# EAGLE design LED_Cube_Board (EAGLE 8.7.1)
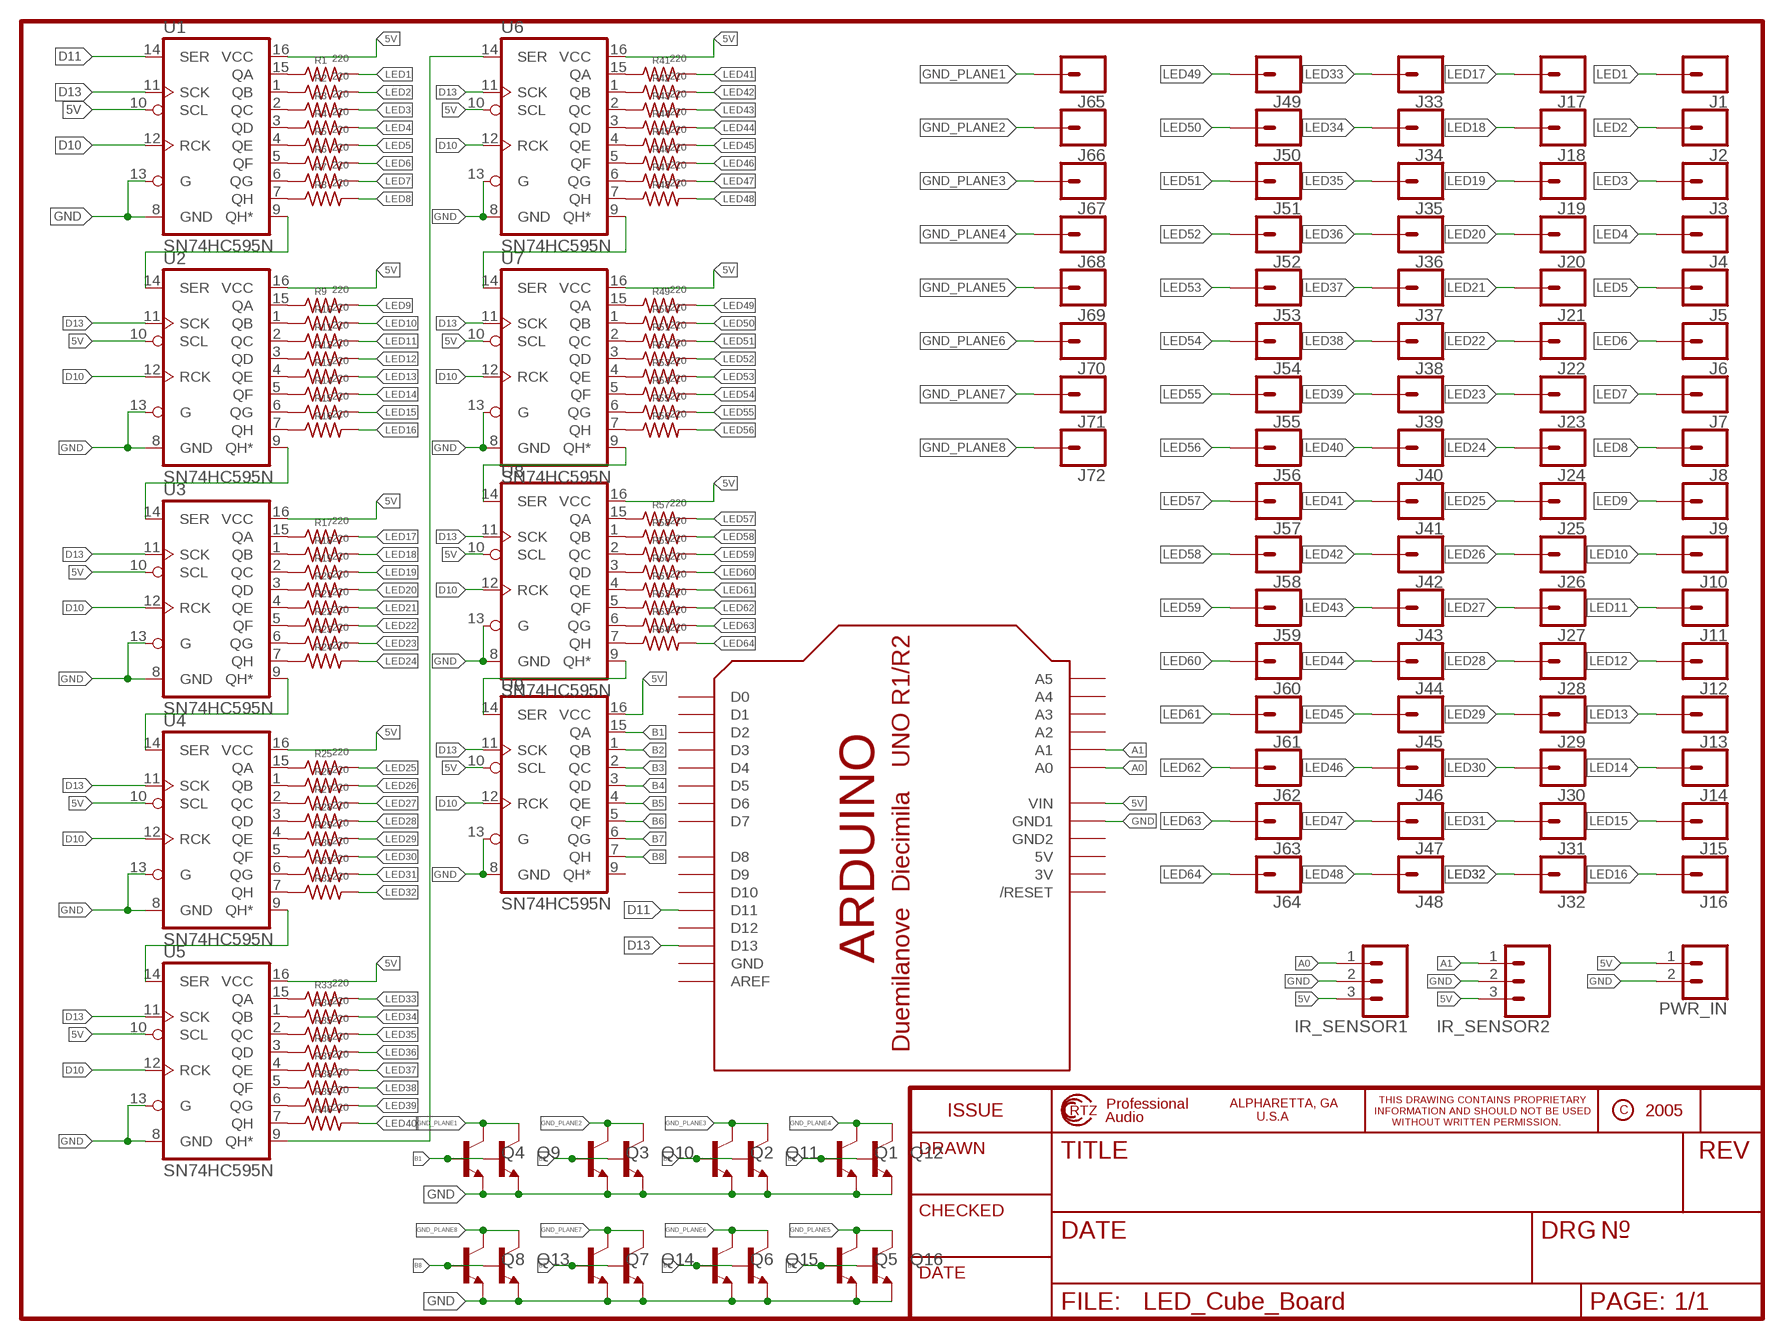
[diagram p0: schematic, sheet 1]

## Parts
IR_SENSOR1  CONN_03  [1X03]
IR_SENSOR2  CONN_03  [1X03]
J1  CONN_01  [1X01]
J2  CONN_01  [1X01]
J3  CONN_01  [1X01]
J4  CONN_01  [1X01]
J5  CONN_01  [1X01]
J6  CONN_01  [1X01]
J7  CONN_01  [1X01]
J8  CONN_01  [1X01]
J9  CONN_01  [1X01]
J10  CONN_01  [1X01]
J11  CONN_01  [1X01]
J12  CONN_01  [1X01]
J13  CONN_01  [1X01]
J14  CONN_01  [1X01]
J15  CONN_01  [1X01]
J16  CONN_01  [1X01]
J17  CONN_01  [1X01]
J18  CONN_01  [1X01]
J19  CONN_01  [1X01]
J20  CONN_01  [1X01]
J21  CONN_01  [1X01]
J22  CONN_01  [1X01]
J23  CONN_01  [1X01]
J24  CONN_01  [1X01]
J25  CONN_01  [1X01]
J26  CONN_01  [1X01]
J27  CONN_01  [1X01]
J28  CONN_01  [1X01]
J29  CONN_01  [1X01]
J30  CONN_01  [1X01]
J31  CONN_01  [1X01]
J32  CONN_01  [1X01]
J33  CONN_01  [1X01]
J34  CONN_01  [1X01]
J35  CONN_01  [1X01]
J36  CONN_01  [1X01]
J37  CONN_01  [1X01]
J38  CONN_01  [1X01]
J39  CONN_01  [1X01]
J40  CONN_01  [1X01]
J41  CONN_01  [1X01]
J42  CONN_01  [1X01]
J43  CONN_01  [1X01]
J44  CONN_01  [1X01]
J45  CONN_01  [1X01]
J46  CONN_01  [1X01]
J47  CONN_01  [1X01]
J48  CONN_01  [1X01]
J49  CONN_01  [1X01]
J50  CONN_01  [1X01]
J51  CONN_01  [1X01]
J52  CONN_01  [1X01]
J53  CONN_01  [1X01]
J54  CONN_01  [1X01]
J55  CONN_01  [1X01]
J56  CONN_01  [1X01]
J57  CONN_01  [1X01]
J58  CONN_01  [1X01]
J59  CONN_01  [1X01]
J60  CONN_01  [1X01]
J61  CONN_01  [1X01]
J62  CONN_01  [1X01]
J63  CONN_01  [1X01]
J64  CONN_01  [1X01]
J65  CONN_01  [1X01]
J66  CONN_01  [1X01]
J67  CONN_01  [1X01]
J68  CONN_01  [1X01]
J69  CONN_01  [1X01]
J70  CONN_01  [1X01]
J71  CONN_01  [1X01]
J72  CONN_01  [1X01]
PWR_IN  CONN_02  [1X02]
Q1  TRANSISTOR_NPNTO92  [TO-92]
Q2  TRANSISTOR_NPNTO92  [TO-92]
Q3  TRANSISTOR_NPNTO92  [TO-92]
Q4  TRANSISTOR_NPNTO92  [TO-92]
Q5  TRANSISTOR_NPNTO92  [TO-92]
Q6  TRANSISTOR_NPNTO92  [TO-92]
Q7  TRANSISTOR_NPNTO92  [TO-92]
Q8  TRANSISTOR_NPNTO92  [TO-92]
Q9  TRANSISTOR_NPNTO92  [TO-92]
Q10  TRANSISTOR_NPNTO92  [TO-92]
Q11  TRANSISTOR_NPNTO92  [TO-92]
Q12  TRANSISTOR_NPNTO92  [TO-92]
Q13  TRANSISTOR_NPNTO92  [TO-92]
Q14  TRANSISTOR_NPNTO92  [TO-92]
Q15  TRANSISTOR_NPNTO92  [TO-92]
Q16  TRANSISTOR_NPNTO92  [TO-92]
R1  220  R-US_R0805  [R0805]
R2  220  R-US_R0805  [R0805]
R3  220  R-US_R0805  [R0805]
R4  220  R-US_R0805  [R0805]
R5  220  R-US_R0805  [R0805]
R6  220  R-US_R0805  [R0805]
R7  220  R-US_R0805  [R0805]
R8  220  R-US_R0805  [R0805]
R9  220  R-US_R0805  [R0805]
R10  220  R-US_R0805  [R0805]
R11  220  R-US_R0805  [R0805]
R12  220  R-US_R0805  [R0805]
R13  220  R-US_R0805  [R0805]
R14  220  R-US_R0805  [R0805]
R15  220  R-US_R0805  [R0805]
R16  220  R-US_R0805  [R0805]
R17  220  R-US_R0805  [R0805]
R18  220  R-US_R0805  [R0805]
R19  220  R-US_R0805  [R0805]
R20  220  R-US_R0805  [R0805]
R21  220  R-US_R0805  [R0805]
R22  220  R-US_R0805  [R0805]
R23  220  R-US_R0805  [R0805]
R24  220  R-US_R0805  [R0805]
R25  220  R-US_R0805  [R0805]
R26  220  R-US_R0805  [R0805]
R27  220  R-US_R0805  [R0805]
R28  220  R-US_R0805  [R0805]
R29  220  R-US_R0805  [R0805]
R30  220  R-US_R0805  [R0805]
R31  220  R-US_R0805  [R0805]
R32  220  R-US_R0805  [R0805]
R33  220  R-US_R0805  [R0805]
R34  220  R-US_R0805  [R0805]
R35  220  R-US_R0805  [R0805]
R36  220  R-US_R0805  [R0805]
R37  220  R-US_R0805  [R0805]
R38  220  R-US_R0805  [R0805]
R39  220  R-US_R0805  [R0805]
R40  220  R-US_R0805  [R0805]
R41  220  R-US_R0805  [R0805]
R42  220  R-US_R0805  [R0805]
R43  220  R-US_R0805  [R0805]
R44  220  R-US_R0805  [R0805]
R45  220  R-US_R0805  [R0805]
R46  220  R-US_R0805  [R0805]
R47  220  R-US_R0805  [R0805]
R48  220  R-US_R0805  [R0805]
R49  220  R-US_R0805  [R0805]
R50  220  R-US_R0805  [R0805]
R51  220  R-US_R0805  [R0805]
R52  220  R-US_R0805  [R0805]
R53  220  R-US_R0805  [R0805]
R54  220  R-US_R0805  [R0805]
R55  220  R-US_R0805  [R0805]
R56  220  R-US_R0805  [R0805]
R57  220  R-US_R0805  [R0805]
R58  220  R-US_R0805  [R0805]
R59  220  R-US_R0805  [R0805]
R60  220  R-US_R0805  [R0805]
R61  220  R-US_R0805  [R0805]
R62  220  R-US_R0805  [R0805]
R63  220  R-US_R0805  [R0805]
R64  220  R-US_R0805  [R0805]
U1  SN74HC595N  74HC595N  [DIP16]
U2  SN74HC595N  74HC595N  [DIP16]
U3  SN74HC595N  74HC595N  [DIP16]
U4  SN74HC595N  74HC595N  [DIP16]
U5  SN74HC595N  74HC595N  [DIP16]
U6  SN74HC595N  74HC595N  [DIP16]
U7  SN74HC595N  74HC595N  [DIP16]
U8  SN74HC595N  74HC595N  [DIP16]
U9  SN74HC595N  74HC595N  [DIP16]
U$1  ARDUINO-BPLACE  [ARDUINO-BPLACE]

## Nets
5V: IR_SENSOR1.3 IR_SENSOR2.3 PWR_IN.1 U1.10(SCL) U1.16(VCC) U2.10(SCL) U2.16(VCC) U3.10(SCL) U3.16(VCC) U4.10(SCL) U4.16(VCC) U5.10(SCL) U5.16(VCC) U6.10(SCL) U6.16(VCC) U7.10(SCL) U7.16(VCC) U8.10(SCL) U8.16(VCC) U9.10(SCL) U9.16(VCC) U$1.VIN
A0: IR_SENSOR1.1 U$1.A0
A1: IR_SENSOR2.1 U$1.A1
B1: Q4.2(B) Q9.2(B) U9.15(QA)
B2: Q3.2(B) Q10.2(B) U9.1(QB)
B3: Q2.2(B) Q11.2(B) U9.2(QC)
B4: Q1.2(B) Q12.2(B) U9.3(QD)
B5: Q5.2(B) Q16.2(B) U9.4(QE)
B6: Q6.2(B) Q15.2(B) U9.5(QF)
B7: Q7.2(B) Q14.2(B) U9.6(QG)
B8: Q8.2(B) Q13.2(B) U9.7(QH)
D10: U1.12(RCK) U2.12(RCK) U3.12(RCK) U4.12(RCK) U5.12(RCK) U6.12(RCK) U7.12(RCK) U8.12(RCK) U9.12(RCK)
D11: U1.14(SER) U$1.D11
D13: U1.11(SCK) U2.11(SCK) U3.11(SCK) U4.11(SCK) U5.11(SCK) U6.11(SCK) U7.11(SCK) U8.11(SCK) U9.11(SCK) U$1.D13
GND: IR_SENSOR1.2 IR_SENSOR2.2 PWR_IN.2 Q1.1(E) Q2.1(E) Q3.1(E) Q4.1(E) Q5.1(E) Q6.1(E) Q7.1(E) Q8.1(E) Q9.1(E) Q10.1(E) Q11.1(E) Q12.1(E) Q13.1(E) Q14.1(E) Q15.1(E) Q16.1(E) U1.8(GND) U1.13(G) U2.8(GND) U2.13(G) U3.8(GND) U3.13(G) U4.8(GND) U4.13(G) U5.8(GND) U5.13(G) U6.8(GND) U6.13(G) U7.8(GND) U7.13(G) U8.8(GND) U8.13(G) U9.8(GND) U9.13(G) U$1.GND1
GND_PLANE1: J65.1 Q4.3(C) Q9.3(C)
GND_PLANE2: J66.1 Q3.3(C) Q10.3(C)
GND_PLANE3: J67.1 Q2.3(C) Q11.3(C)
GND_PLANE4: J68.1 Q1.3(C) Q12.3(C)
GND_PLANE5: J69.1 Q5.3(C) Q16.3(C)
GND_PLANE6: J70.1 Q6.3(C) Q15.3(C)
GND_PLANE7: J71.1 Q7.3(C) Q14.3(C)
GND_PLANE8: J72.1 Q8.3(C) Q13.3(C)
LED1: J1.1 R1.2
LED2: J2.1 R2.2
LED3: J3.1 R3.2
LED4: J4.1 R4.2
LED5: J5.1 R5.2
LED6: J6.1 R6.2
LED7: J7.1 R7.2
LED8: J8.1 R8.2
LED9: J9.1 R9.2
LED10: J10.1 R10.2
LED11: J11.1 R11.2
LED12: J12.1 R12.2
LED13: J13.1 R13.2
LED14: J14.1 R14.2
LED15: J15.1 R15.2
LED16: J16.1 R16.2
LED17: J17.1 R17.2
LED18: J18.1 R18.2
LED19: J19.1 R19.2
LED20: J20.1 R20.2
LED21: J21.1 R21.2
LED22: J22.1 R22.2
LED23: J23.1 R23.2
LED24: J24.1 R24.2
LED25: J25.1 R25.2
LED26: J26.1 R26.2
LED27: J27.1 R27.2
LED28: J28.1 R28.2
LED29: J29.1 R29.2
LED30: J30.1 R30.2
LED31: J31.1 R31.2
LED32: J32.1 R32.2
LED33: J33.1 R33.2
LED34: J34.1 R34.2
LED35: J35.1 R35.2
LED36: J36.1 R36.2
LED37: J37.1 R37.2
LED38: J38.1 R38.2
LED39: J39.1 R39.2
LED40: J40.1 R40.2
LED41: J41.1 R41.2
LED42: J42.1 R42.2
LED43: J43.1 R43.2
LED44: J44.1 R44.2
LED45: J45.1 R45.2
LED46: J46.1 R46.2
LED47: J47.1 R47.2
LED48: J48.1 R48.2
LED49: J49.1 R49.2
LED50: J50.1 R50.2
LED51: J51.1 R51.2
LED52: J52.1 R52.2
LED53: J53.1 R53.2
LED54: J54.1 R54.2
LED55: J55.1 R55.2
LED56: J56.1 R56.2
LED57: J57.1 R57.2
LED58: J58.1 R58.2
LED59: J59.1 R59.2
LED60: J60.1 R60.2
LED61: J61.1 R61.2
LED62: J62.1 R62.2
LED63: J63.1 R63.2
LED64: J64.1 R64.2
N$1: R1.1 U1.15(QA)
N$2: R2.1 U1.1(QB)
N$3: R3.1 U1.2(QC)
N$4: U1.9(QH*) U2.14(SER)
N$5: U2.9(QH*) U3.14(SER)
N$6: U3.9(QH*) U4.14(SER)
N$7: U4.9(QH*) U5.14(SER)
N$8: U5.9(QH*) U6.14(SER)
N$9: U6.9(QH*) U7.14(SER)
N$10: U7.9(QH*) U8.14(SER)
N$11: R4.1 U1.3(QD)
N$12: R5.1 U1.4(QE)
N$13: R6.1 U1.5(QF)
N$14: R7.1 U1.6(QG)
N$15: R8.1 U1.7(QH)
N$16: R9.1 U2.15(QA)
N$17: R10.1 U2.1(QB)
N$18: R11.1 U2.2(QC)
N$19: R12.1 U2.3(QD)
N$20: R13.1 U2.4(QE)
N$21: R14.1 U2.5(QF)
N$22: R15.1 U2.6(QG)
N$23: R16.1 U2.7(QH)
N$24: R17.1 U3.15(QA)
N$25: R18.1 U3.1(QB)
N$26: R19.1 U3.2(QC)
N$27: R20.1 U3.3(QD)
N$28: R21.1 U3.4(QE)
N$29: R22.1 U3.5(QF)
N$30: R23.1 U3.6(QG)
N$31: R24.1 U3.7(QH)
N$32: R25.1 U4.15(QA)
N$33: R26.1 U4.1(QB)
N$34: R27.1 U4.2(QC)
N$35: R28.1 U4.3(QD)
N$36: R29.1 U4.4(QE)
N$37: R30.1 U4.5(QF)
N$38: R31.1 U4.6(QG)
N$39: R32.1 U4.7(QH)
N$40: R33.1 U5.15(QA)
N$41: R34.1 U5.1(QB)
N$42: R35.1 U5.2(QC)
N$43: R36.1 U5.3(QD)
N$44: R37.1 U5.4(QE)
N$45: R38.1 U5.5(QF)
N$46: R39.1 U5.6(QG)
N$47: R40.1 U5.7(QH)
N$48: R41.1 U6.15(QA)
N$49: R42.1 U6.1(QB)
N$50: R43.1 U6.2(QC)
N$51: R44.1 U6.3(QD)
N$52: R45.1 U6.4(QE)
N$53: R46.1 U6.5(QF)
N$54: R47.1 U6.6(QG)
N$55: R48.1 U6.7(QH)
N$56: R49.1 U7.15(QA)
N$57: R50.1 U7.1(QB)
N$58: R51.1 U7.2(QC)
N$59: R52.1 U7.3(QD)
N$60: R53.1 U7.4(QE)
N$61: R54.1 U7.5(QF)
N$62: R55.1 U7.6(QG)
N$63: R56.1 U7.7(QH)
N$65: R57.1 U8.15(QA)
N$66: R58.1 U8.1(QB)
N$67: R59.1 U8.2(QC)
N$68: R60.1 U8.3(QD)
N$69: R61.1 U8.4(QE)
N$70: R62.1 U8.5(QF)
N$71: R63.1 U8.6(QG)
N$72: R64.1 U8.7(QH)
N$81: U8.9(QH*) U9.14(SER)
Unconnected: U9.9(QH*) U$1.A2 U$1.A3 U$1.A4 U$1.A5 U$1.AREF U$1.D0 U$1.D1 U$1.D2 U$1.D3 U$1.D4 U$1.D5 U$1.D6 U$1.D7 U$1.D8 U$1.D9 U$1.D10 U$1.D12 U$1.RESET(/RESET)

## Power pins joined to a net without a drawn wire
3V: U$1.3V
5V: U$1.5V
GND: U$1.GND
GND2: U$1.GND2

## Library data of the parts
IR_SENSOR1 IR_SENSOR2 = SparkFun-Connectors:CONN_03: Multi connection point. Often used as Generic Header-pin footprint for 0.1 inch spaced/style header connections On any of the 0.1 inch spaced packages, you can populate with these: Break Away Headers - Straight <https://www.sparkfun.com/products/116> (PRT-00116) Break Away Male Headers - Right Angle <https://www.sparkfun.com/products/553> (PRT-00553) Female Headers <https://www.sparkfun.com/products/115> (PRT-00115) Break Away Headers - Machine Pin <https://www.sparkfun.com/products/117> (PRT-00117) Break Away Female Headers - Swiss Machine Pin <https://www.sparkfun.com/products/743> (PRT-00743) Stackable Header - 3 Pin (Female, 0.1") <https://www.sparkfun.com/products/13875> (PRT-13875) For SCREWTERMINALS and SPRING TERMINALS visit here: Screw Terimnals on SparkFun.com <https://www.sparkfun.com/search/results?term=Screw+Terminals> (5mm/3.5mm/2.54mm spacing) This device is also useful as a general connection point to wire up your design to another part of your project. Our various solder wires solder well into these plated through hole pads. Hook-Up Wire - Assortment (Stranded, 22 AWG) <https://www.sparkfun.com/products/11375> (PRT-11375) Hook-Up Wire - Assortment (Solid Core, 22 AWG) <https://www.sparkfun.com/products/11367> (PRT-11367) View the entire wire category on our website here <https://www.sparkfun.com/categories/141> Special notes: Molex polarized connector foot print use with SKU : PRT-08232 with associated crimp pins and housings.
J1-J72 = SparkFun-Connectors:CONN_01: Single connection point. Often used as Generic Header-pin footprint for 0.1 inch spaced/style header connections On any of the 0.1 inch spaced packages, you can populate with these: Break Away Headers - Straight <https://www.sparkfun.com/products/116> (PRT-00116) Break Away Male Headers - Right Angle <https://www.sparkfun.com/products/553> (PRT-00553) Female Headers <https://www.sparkfun.com/products/115> (PRT-00115) Break Away Headers - Machine Pin <https://www.sparkfun.com/products/117> (PRT-00117) Break Away Female Headers - Swiss Machine Pin <https://www.sparkfun.com/products/743> (PRT-00743) This device is also useful as a general connection point to wire up your design to another part of your project. Our various solder wires solder well into these plated through hole pads. Hook-Up Wire - Assortment (Stranded, 22 AWG) <https://www.sparkfun.com/products/11375> (PRT-11375) Hook-Up Wire - Assortment (Solid Core, 22 AWG) <https://www.sparkfun.com/products/11367> (PRT-11367) View the entire wire category on our website here <https://www.sparkfun.com/categories/141> Special notes: SMTSO-256-ET is a "flush mount" nut for a 4-40 screw. We mostly use this on specialty testbeds; it is a nice way to connect hardware to your PCB at an adjustable hieght. Also note, the SNAP packages are for using a snappable style connector. We sell a baggie of snaps and they are also used on two LilyPad designs: Snap Assortment - 30 pack (male and female) <https://www.sparkfun.com/products/11347> (DEV-11347) LilyPad Arduino SimpleSnap <https://www.sparkfun.com/products/10941> (DEV-10941) LilyPad SimpleSnap Protoboard <https://www.sparkfun.com/products/10940> (DEV-10940)
PWR_IN = SparkFun-Connectors:CONN_02: Multi connection point. Often used as Generic Header-pin footprint for 0.1 inch spaced/style header connections On any of the 0.1 inch spaced packages, you can populate with these: Break Away Headers - Straight <https://www.sparkfun.com/products/116> (PRT-00116) Break Away Male Headers - Right Angle <https://www.sparkfun.com/products/553> (PRT-00553) Female Headers <https://www.sparkfun.com/products/115> (PRT-00115) Break Away Headers - Machine Pin <https://www.sparkfun.com/products/117> (PRT-00117) Break Away Female Headers - Swiss Machine Pin <https://www.sparkfun.com/products/743> (PRT-00743) For SCREWTERMINALS and SPRING TERMINALS visit here: Screw Terimnals on SparkFun.com <https://www.sparkfun.com/search/results?term=Screw+Terminals> (5mm/3.5mm/2.54mm spacing) This device is also useful as a general connection point to wire up your design to another part of your project. Our various solder wires solder well into these plated through hole pads. Hook-Up Wire - Assortment (Stranded, 22 AWG) <https://www.sparkfun.com/products/11375> (PRT-11375) Hook-Up Wire - Assortment (Solid Core, 22 AWG) <https://www.sparkfun.com/products/11367> (PRT-11367) View the entire wire category on our website here <https://www.sparkfun.com/categories/141> Special notes: Molex polarized connector foot print use with: PRT-08233 with associated crimp pins and housings. 2.54_SCREWTERM for use with PRT-10571. 3.5mm Screw Terminal footprints for PRT-08084 5mm Screw Terminal footprints for use with PRT-08432
Q1-Q16 = SparkFun:TRANSISTOR_NPN: Transistor NPN BJT configuration in SOT23 package. MMBT2222 is the common NPN we use. Double check BCE configuration again layout.
R1-R64 = adafruit:R-US_: RESISTOR, American symbol
U1-U9 = SparkFun-IC-Logic:74*595: 8-Bit Shift Register (Serial to Parallel) Datasheet <http://cdn.sparkfun.com/datasheets/BreakoutBoards/MM74HC595.pdf> SparkFun Products SparkFun Shift Register Breakout - 74HC595 <https://www.sparkfun.com/products/10680> (BOB-10680); PROD_ID: IC-13123
U$1 = adafruit:ARDUINO: Arduino Diecimila/Duemilanove Make a shield with ease, this package has all the named pins as well as the two mounting drill holes and an outline of the USB and DC power connector. The outline is on the DIMENSION layer, so if your board house uses it they will cut the outline to match. http://www.ladyada.net/library/pcb/eaglelibrary.html

## Board
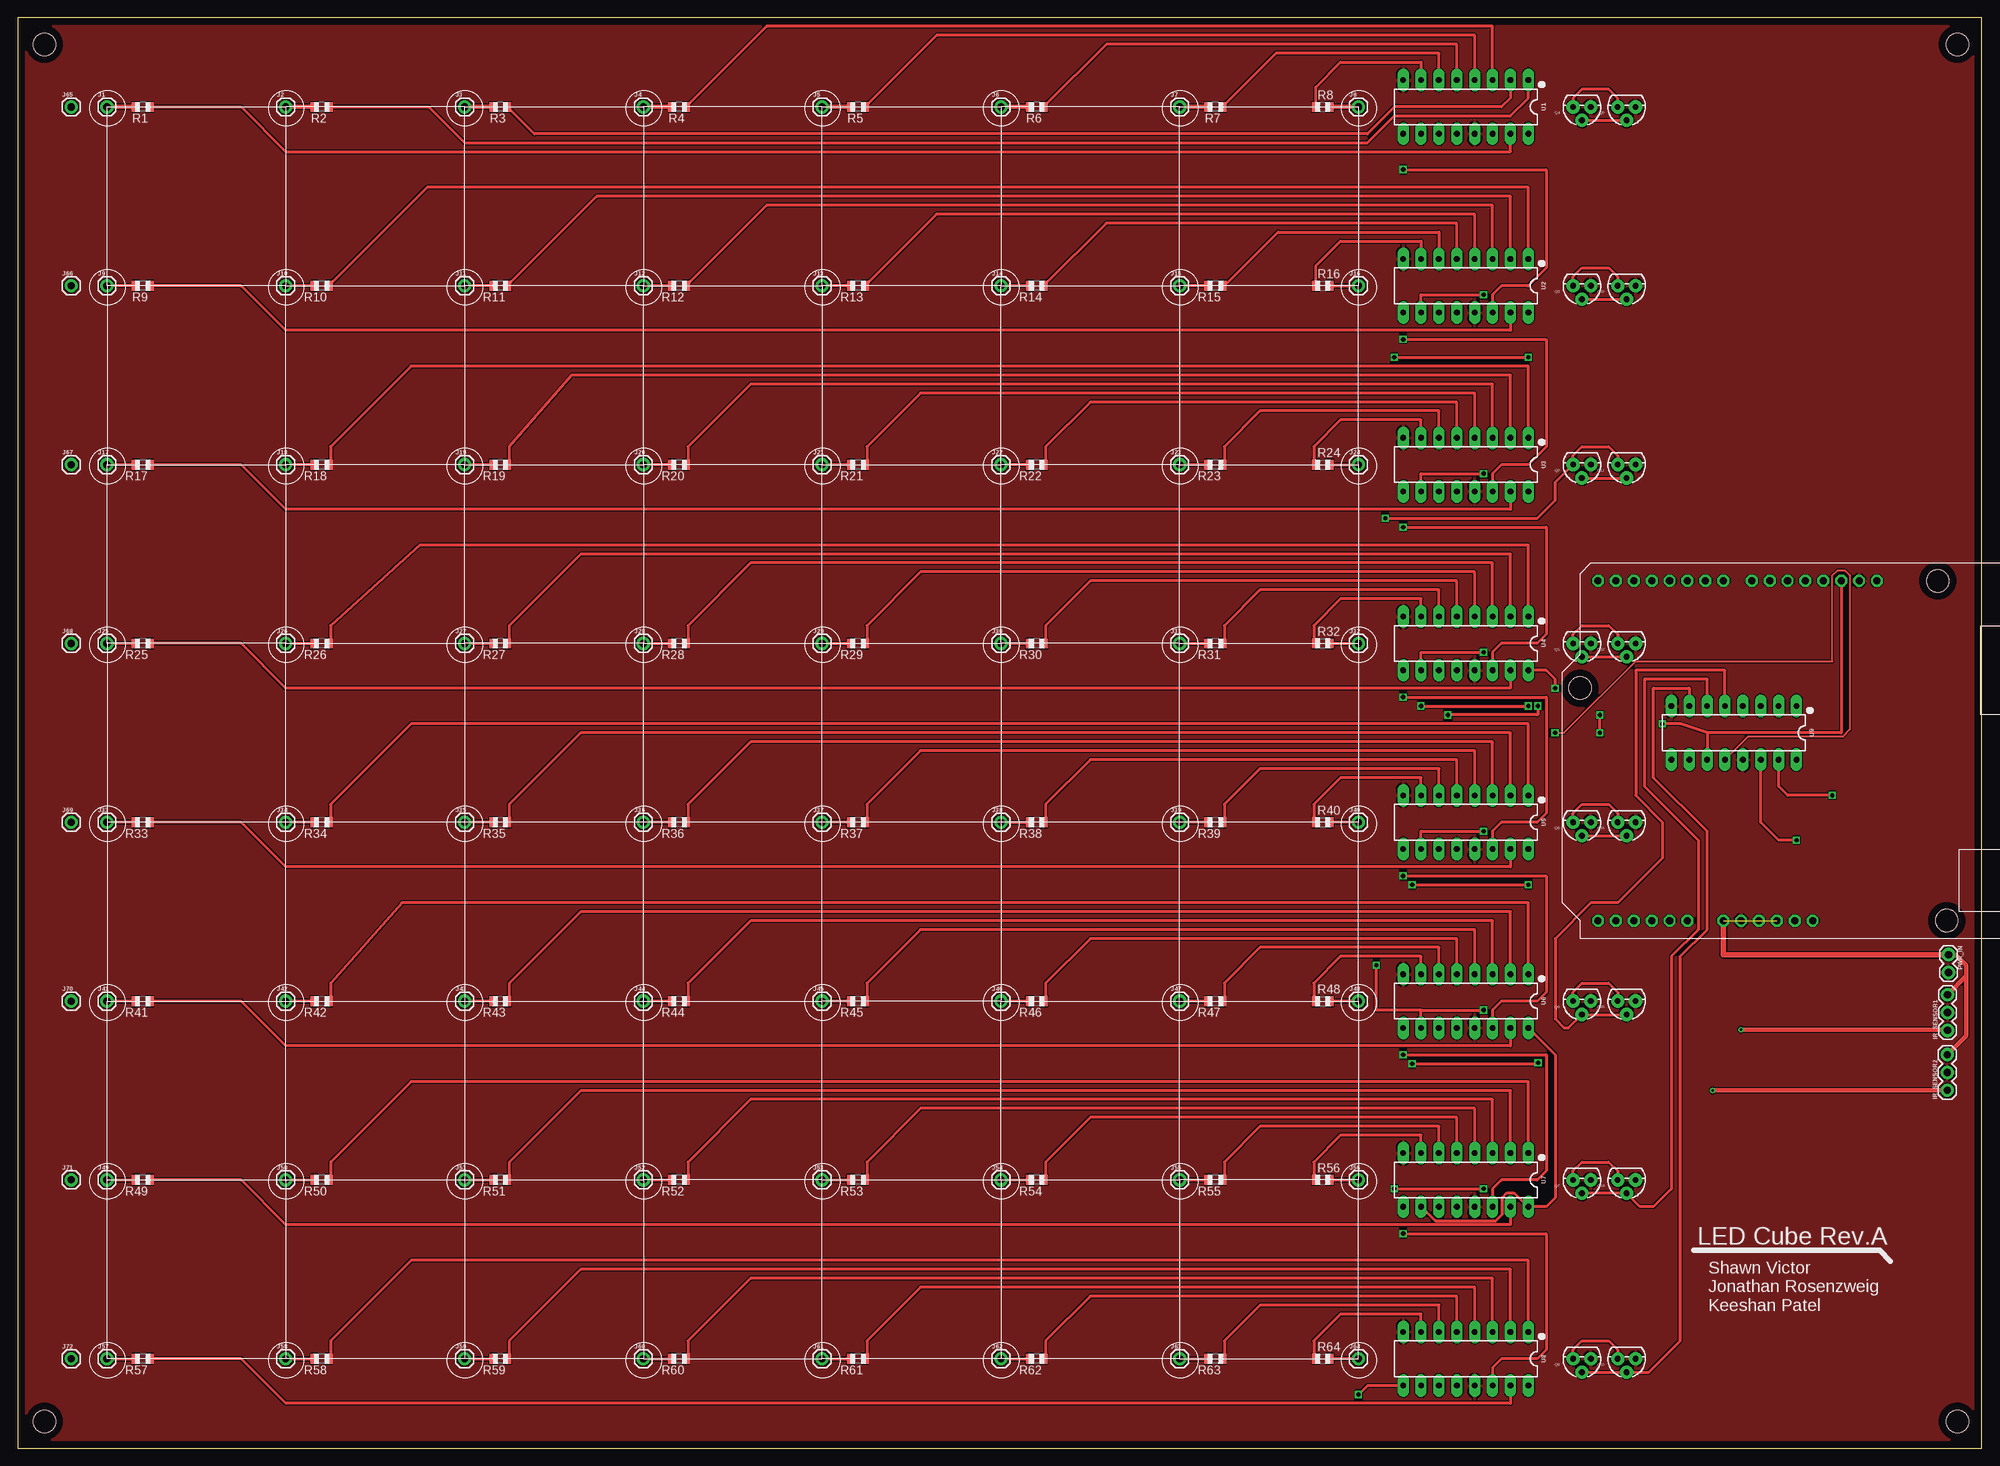
[diagram p1: board, top side]
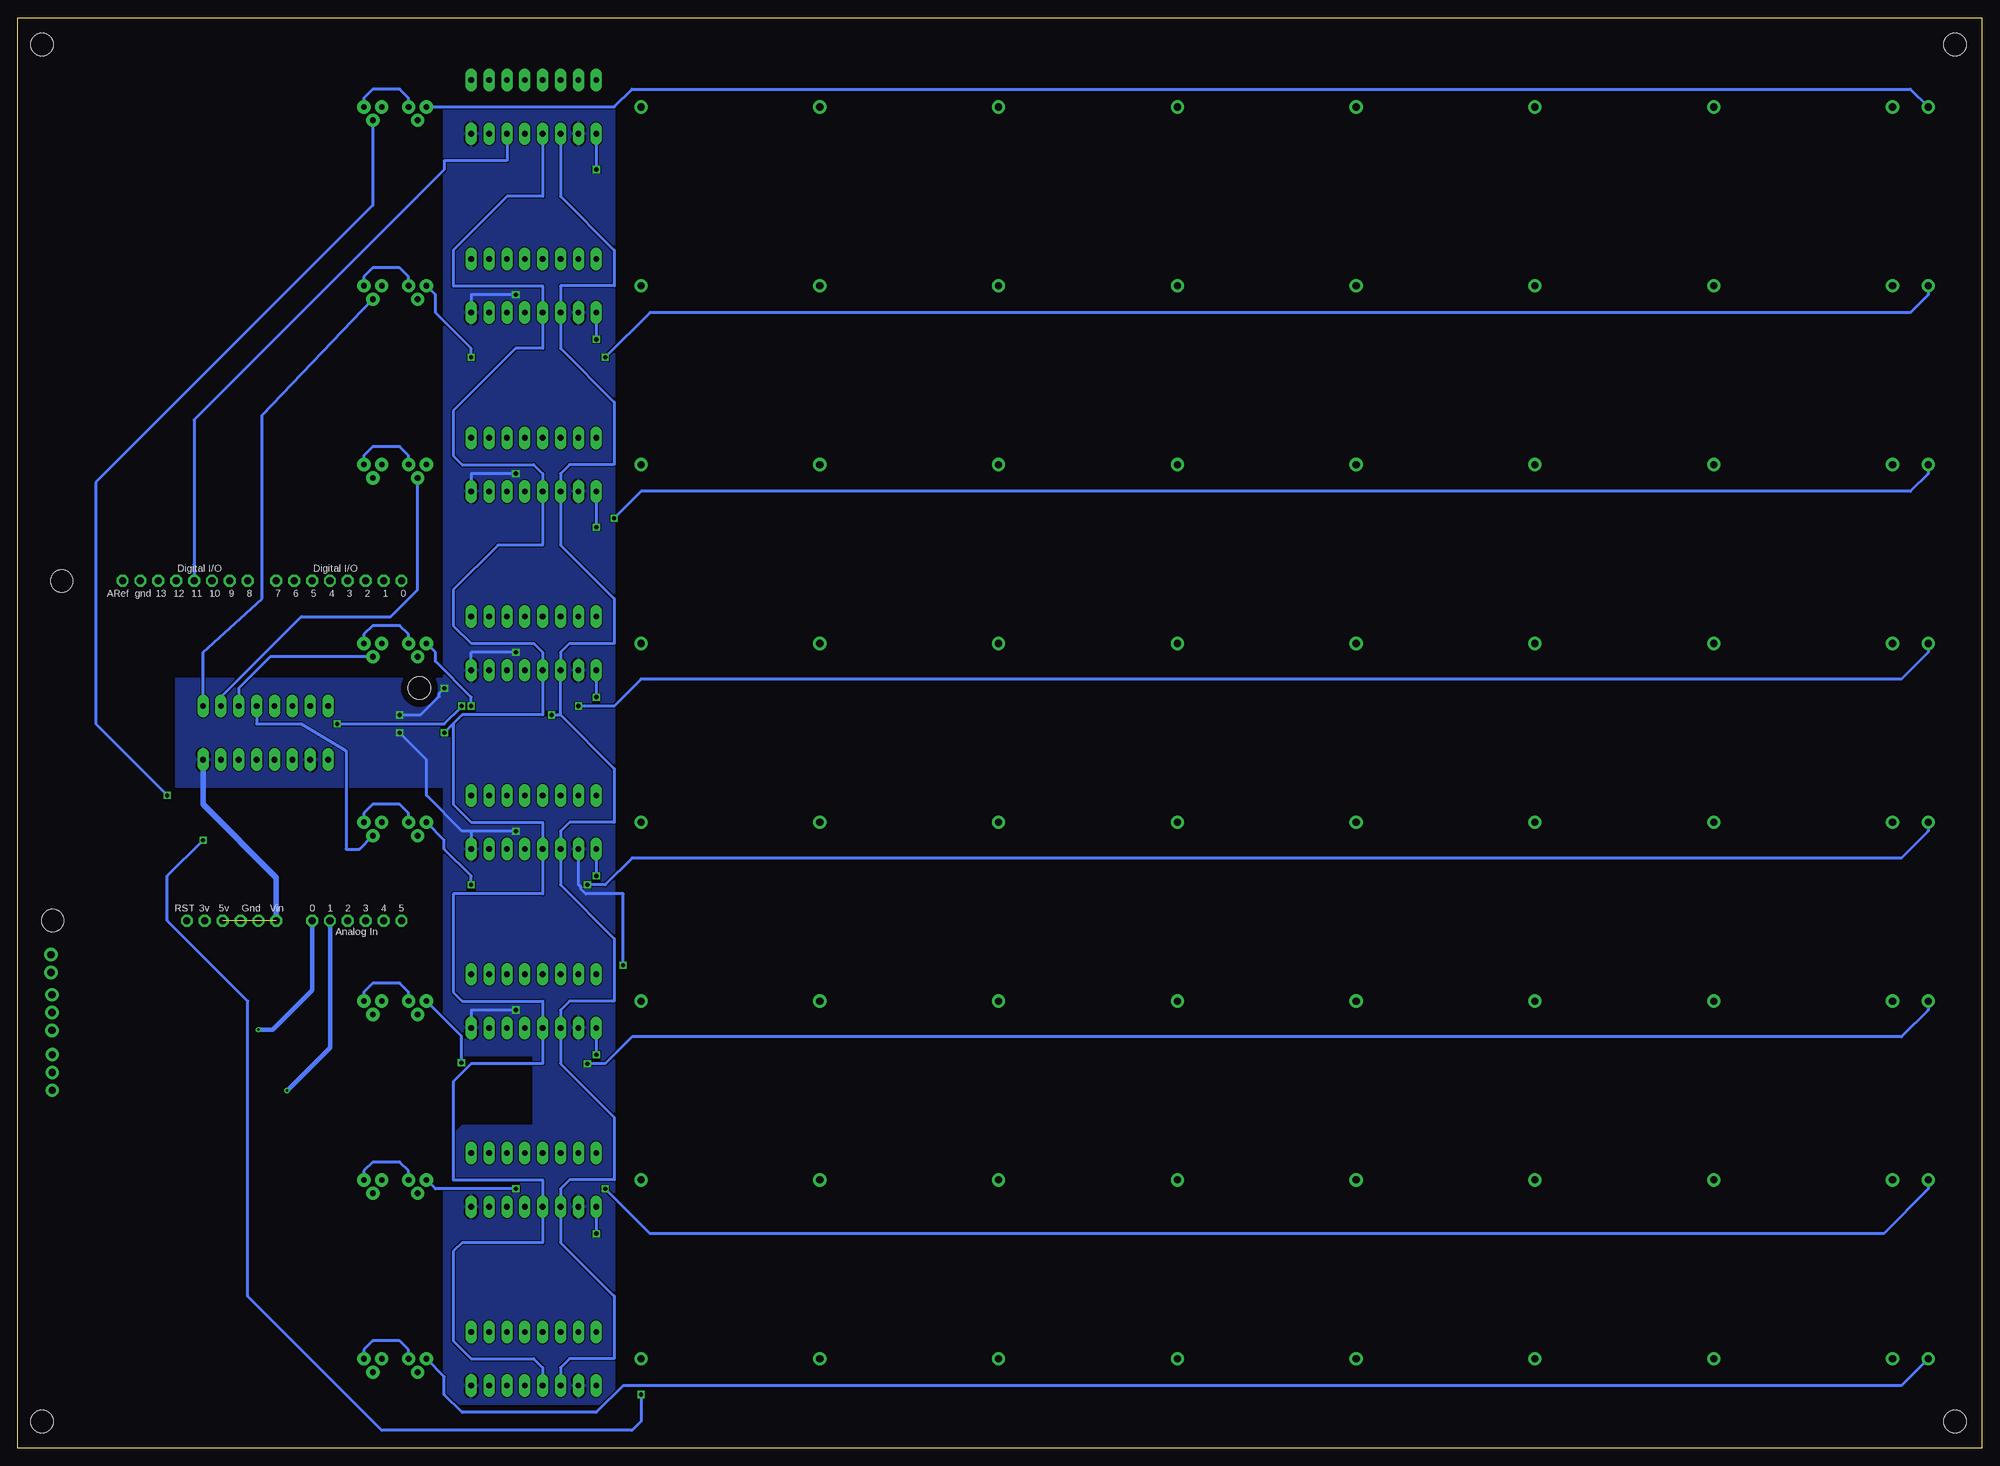
[diagram p2: board, bottom side, seen from below]

Size 279.07 x 203.19 mm. Coordinates in mm from the lower left corner, seen from the top.
Outline: 0,0 279.07,0 279.07,203.19 0,203.19 0,0
Copper layers (1*16): Top 0.035mm / dielectric 1.5mm / Bottom 0.035mm
Design rules "default": minimum track width 6mil, minimum drill 0.35mm, track to track 6mil, track to pad 6mil, pad to pad 6mil, via to via 6mil, smd to smd 6mil, copper to edge 40mil, drill to drill 6mil, minimum pad ring 10mil, minimum via ring 8mil, stop-mask expansion 4mil, vias tented up to drill 0mil, thermal gap 10mil
Holes 3.2 mm at 3.81,199.39 275.59,199.39 3.81,3.81 275.59,3.81

### Footprints (pad centres in the part's own frame; a part is rotated, then mirrored left to right if it is on the bottom)
1X03 = drill 1.016 pad 1.88: 1 0,0; 2 2.54,0; 3 5.08,0
1X01 = drill 1.016 pad 1.88: 1 0,0
1X02 = drill 1.016 pad 1.88: 1 0,0; 2 2.54,0
TO-92 = drill 0.813 pad 1.88: 1 -1.27,0; 2 0,1.905; 3 1.27,0
R0805 = smd 1.1 x 1.4: 1 -1,0; 2 1,0
DIP16 = drill 0.813 pad 1.626 long: 1 -8.89,-3.81; 2 -6.35,-3.81; 3 -3.81,-3.81; 4 -1.27,-3.81; 5 1.27,-3.81; 6 3.81,-3.81; 7 6.35,-3.81; 8 8.89,-3.81; 9 8.89,3.81; 10 6.35,3.81; 11 3.81,3.81; 12 1.27,3.81; 13 -1.27,3.81; 14 -3.81,3.81; 15 -6.35,3.81; 16 -8.89,3.81
ARDUINO-BPLACE = drill 1 pad 1.676 octagon: 3V 35.56,2.54; 5V 38.1,2.54; A0 50.8,2.54; A1 53.34,2.54; A2 55.88,2.54; A3 58.42,2.54; A4 60.96,2.54; A5 63.5,2.54; AREF 23.876,50.8; D0 63.5,50.8; D1 60.96,50.8; D2 58.42,50.8; D3 55.88,50.8; D4 53.34,50.8; D5 50.8,50.8; D6 48.26,50.8; D7 45.72,50.8; D8 41.656,50.8; D9 39.116,50.8; D10 36.576,50.8; D11 34.036,50.8; D12 31.496,50.8; D13 28.956,50.8; GND 26.416,50.8; GND1 43.18,2.54; GND2 40.64,2.54; RESET 33.02,2.54; VIN 45.72,2.54 | hole 3.2: 15.24,50.8; 66.04,35.56; 13.97,2.54

### Placement (x,y rotation side)
IR_SENSOR1  274.19,59.33 90 top
IR_SENSOR2  274.16,50.82 90 top
J1  12.7,190.5 0 top
J2  38.1,190.5 0 top
J3  63.5,190.5 0 top
J4  88.9,190.5 0 top
J5  114.3,190.5 0 top
J6  139.7,190.5 0 top
J7  165.1,190.5 0 top
J8  190.5,190.5 0 top
J9  12.7,165.1 0 top
J10  38.1,165.1 0 top
J11  63.5,165.1 0 top
J12  88.9,165.1 0 top
J13  114.3,165.1 0 top
J14  139.7,165.1 0 top
J15  165.1,165.1 0 top
J16  190.5,165.1 0 top
J17  12.7,139.7 0 top
J18  38.1,139.7 0 top
J19  63.5,139.7 0 top
J20  88.9,139.7 0 top
J21  114.3,139.7 0 top
J22  139.7,139.7 0 top
J23  165.1,139.7 0 top
J24  190.5,139.7 0 top
J25  12.7,114.3 0 top
J26  38.1,114.3 0 top
J27  63.5,114.3 0 top
J28  88.9,114.3 0 top
J29  114.3,114.3 0 top
J30  139.7,114.3 0 top
J31  165.1,114.3 0 top
J32  190.5,114.3 0 top
J33  12.7,88.9 0 top
J34  38.1,88.9 0 top
J35  63.5,88.9 0 top
J36  88.9,88.9 0 top
J37  114.3,88.9 0 top
J38  139.7,88.9 0 top
J39  165.1,88.9 0 top
J40  190.5,88.9 0 top
J41  12.7,63.5 0 top
J42  38.1,63.5 0 top
J43  63.5,63.5 0 top
J44  88.9,63.5 0 top
J45  114.3,63.5 0 top
J46  139.7,63.5 0 top
J47  165.1,63.5 0 top
J48  190.5,63.5 0 top
J49  12.7,38.1 0 top
J50  38.1,38.1 0 top
J51  63.5,38.1 0 top
J52  88.9,38.1 0 top
J53  114.3,38.1 0 top
J54  139.7,38.1 0 top
J55  165.1,38.1 0 top
J56  190.5,38.1 0 top
J57  12.7,12.7 0 top
J58  38.1,12.7 0 top
J59  63.5,12.7 0 top
J60  88.9,12.7 0 top
J61  114.3,12.7 0 top
J62  139.7,12.7 0 top
J63  165.1,12.7 0 top
J64  190.5,12.7 0 top
J65  7.62,190.5 0 top
J66  7.62,165.1 0 top
J67  7.62,139.7 0 top
J68  7.62,114.3 0 top
J69  7.62,88.9 0 top
J70  7.62,63.5 0 top
J71  7.62,38.1 0 top
J72  7.62,12.7 0 top
PWR_IN  274.32,70.1 270 top
Q1  222.25,114.3 180 top
Q2  222.25,139.7 180 top
Q3  222.25,165.1 180 top
Q4  222.25,190.5 180 top
Q5  222.25,88.9 180 top
Q6  222.25,63.5 180 top
Q7  222.25,38.1 180 top
Q8  222.25,12.7 180 top
Q9  228.6,190.5 180 top
Q10  228.6,165.1 180 top
Q11  228.6,139.7 180 top
Q12  228.6,114.3 180 top
Q13  228.6,12.7 180 top
Q14  228.6,38.1 180 top
Q15  228.6,63.5 180 top
Q16  228.6,88.9 180 top
R1  17.78,190.5 180 top
R2  43.18,190.5 180 top
R3  68.58,190.5 180 top
R4  93.98,190.5 180 top
R5  119.38,190.5 180 top
R6  144.78,190.5 180 top
R7  170.18,190.5 180 top
R8  185.42,190.5 0 top
R9  17.78,165.1 180 top
R10  43.18,165.1 180 top
R11  68.58,165.1 180 top
R12  93.98,165.1 180 top
R13  119.38,165.1 180 top
R14  144.78,165.1 180 top
R15  170.18,165.1 180 top
R16  185.42,165.1 0 top
R17  17.78,139.7 180 top
R18  43.18,139.7 180 top
R19  68.58,139.7 180 top
R20  93.98,139.7 180 top
R21  119.38,139.7 180 top
R22  144.78,139.7 180 top
R23  170.18,139.7 180 top
R24  185.42,139.7 0 top
R25  17.78,114.3 180 top
R26  43.18,114.3 180 top
R27  68.58,114.3 180 top
R28  93.98,114.3 180 top
R29  119.38,114.3 180 top
R30  144.78,114.3 180 top
R31  170.18,114.3 180 top
R32  185.42,114.3 0 top
R33  17.78,88.9 180 top
R34  43.18,88.9 180 top
R35  68.58,88.9 180 top
R36  93.98,88.9 180 top
R37  119.38,88.9 180 top
R38  144.78,88.9 180 top
R39  170.18,88.9 180 top
R40  185.42,88.9 0 top
R41  17.78,63.5 180 top
R42  43.18,63.5 180 top
R43  68.58,63.5 180 top
R44  93.98,63.5 180 top
R45  119.38,63.5 180 top
R46  144.78,63.5 180 top
R47  170.18,63.5 180 top
R48  185.42,63.5 0 top
R49  17.78,38.1 180 top
R50  43.18,38.1 180 top
R51  68.58,38.1 180 top
R52  93.98,38.1 180 top
R53  119.38,38.1 180 top
R54  144.78,38.1 180 top
R55  170.18,38.1 180 top
R56  185.42,38.1 0 top
R57  17.78,12.7 180 top
R58  43.18,12.7 180 top
R59  68.58,12.7 180 top
R60  93.98,12.7 180 top
R61  119.38,12.7 180 top
R62  144.78,12.7 180 top
R63  170.18,12.7 180 top
R64  185.42,12.7 0 top
U1  205.74,190.5 180 top
U2  205.74,165.1 180 top
U3  205.74,139.7 180 top
U4  205.74,114.3 180 top
U5  205.74,88.9 180 top
U6  205.74,63.5 180 top
U7  205.74,38.1 180 top
U8  205.74,12.7 180 top
U9  243.84,101.6 180 top
U$1  288.04,72.39 0 bottom

### Tracks (layer width: path | path; a pad name or v marks a point on that pad's centre or on a via)
5V  (via drill 0.6)  (1 unrouted)
  Top 0.406: U2.10 199.39,163.83 v208.28,163.83 | U3.10 199.39,138.43 v208.28,138.43 | U4.10 199.39,113.03 v208.28,113.03 | U5.10 199.39,87.63 v208.28,87.63 | U6.10 199.39,62.23 | 199.39,62.23 v208.28,62.23 | U7.10 199.47,34.29 201.45,32.31 210.03,32.31 210.92,33.2 210.92,35.59 211.61,36.27 212.57,36.27 214.56,34.29 U7.16 217.17,34.29 218.44,35.56 218.44,55.88 U6.16 | v224.79,101.6 v224.79,104.14 | v218.44,107.95 218.44,109.22 217.17,110.49 U4.16 | 199.39,62.23 193.04,62.23 v193.04,68.58
  Top 0.61: PWR_IN.1 275.34,70.1 276.86,68.58 276.86,67.09 | 276.86,67.09 IR_SENSOR1.3 | 276.86,67.09 276.86,58.6 IR_SENSOR2.3
  Top 0.813: U$1.VIN 242.32,70.1 PWR_IN.1
  Bottom 0.406: v208.28,163.83 214.63,163.83 U2.16 | v208.28,138.43 214.63,138.43 U3.16 | v208.28,113.03 214.63,113.03 U4.16 | v208.28,87.63 214.63,87.63 | 214.63,87.63 U5.16 | v208.28,62.23 214.63,62.23 U6.16 | 214.63,87.63 215.9,87.63 220.98,92.71 220.98,97.79 v224.79,101.6 | v218.44,107.95 219.18,107.21 219.18,106.78 221.82,104.14 v224.79,104.14 | v193.04,68.58 193.04,78.74 198.36,78.74 198.98,79.36 198.98,79.6 199.39,80.01 U5.10
  Bottom 0.813: U$1.VIN 242.32,81.03 252.73,91.44 U9.16
  pour Bottom: 194.31,196.85 218.44,196.85 218.44,109.22 256.54,109.22 256.54,93.98 218.44,93.98 218.44,58.42 215.9,55.88 205.74,55.88 205.74,45.72 215.9,45.72 218.44,43.18 218.44,7.62 217.17,6.35 194.31,6.35
A0  (via drill 0.35)
  Top 0.61: v244.86,59.44 274.09,59.44 IR_SENSOR1.1
  Bottom 0.61: U$1.A0 237.24,65.02 242.82,59.44 v244.86,59.44
A1  (via drill 0.35)
  Top 0.61: IR_SENSOR2.1 240.81,50.82 v240.79,50.8
  Bottom 0.61: v240.79,50.8 234.7,56.9 U$1.A1
B1  (via drill 0.6)
  Top 0.406: Q4.2 Q9.2 | v257.81,92.71 251.46,92.71 250.19,93.98 U9.15
  Bottom 0.406: Q9.2 228.6,176.53 267.97,137.16 267.97,102.87 v257.81,92.71
B2
  Top 0.406: Q3.2 Q10.2
  Bottom 0.406: U9.1 252.73,113.03 244.35,120.65 244.35,146.69 Q10.2
B3
  Top 0.406: Q2.2 Q11.2
  Bottom 0.406: U9.2 250.19,106.68 238.76,118.11 226.06,118.11 222.25,121.92 Q2.2
B4
  Top 0.406: Q1.2 Q12.2
  Bottom 0.406: Q12.2 243.21,112.39 247.65,107.95 U9.3
B5
  Top 0.406: Q5.2 Q16.2
  Bottom 0.406: U9.4 245.11,102.87 238.76,102.87 232.41,99.06 232.41,85.09 230.5,85.09 Q16.2
B6
  Top 0.406: Q15.2 Q6.2 220.34,59.69 219.71,59.69 218.44,60.96 218.44,72.39 223.52,77.47 227.33,77.47 233.68,83.82 233.68,88.9 229.87,92.71 229.87,110.49 242.57,110.49 U9.5
B7
  Top 0.406: Q7.2 Q14.2 230.5,34.29 232.41,34.29 234.95,36.83 234.95,69.85 238.76,73.66 238.76,86.36 231.14,93.98 231.14,109.22 240.03,109.22 U9.6
B8
  Top 0.406: Q8.2 Q13.2 231.78,10.79 236.22,15.24 236.22,69.85 240.03,73.66 240.03,87.63 232.41,95.25 232.41,107.95 237.49,107.95 U9.7
D10  (via drill 0.6)
  Top 0.254: v218.44,101.6 219.71,101.6 229.87,111.76 257.82,111.76 257.82,124.02 258.59,124.69 259.57,124.69 260.33,124.02 260.33,102.09 259.31,101.04 245.82,101.04 U9.12
  Bottom 0.406: U1.12 204.47,177.8 209.55,177.8 217.17,170.18 217.17,165.1 204.47,165.1 U2.12 204.47,156.21 208.28,156.21 217.17,147.32 217.17,140.97 215.9,139.7 205.74,139.7 204.47,138.43 U3.12 204.47,128.27 210.82,128.27 217.17,121.92 217.17,116.84 214.63,114.3 205.74,114.3 204.47,113.03 U4.12 204.47,104.14 215.9,104.14 217.17,102.87 | 217.17,102.87 217.17,91.44 214.63,88.9 204.47,88.9 U5.12 204.47,78.74 217.17,78.74 217.17,64.77 215.9,63.5 204.47,63.5 U6.12 204.47,54.61 214.63,54.61 217.17,52.07 217.17,38.1 204.47,38.1 U7.12 204.47,29.21 215.9,29.21 217.17,27.94 217.17,15.24 214.63,12.7 205.74,12.7 204.47,11.43 U8.12 | 217.17,102.87 v218.44,101.6
D11
  Bottom 0.406: U1.14 209.55,182.88 218.44,182.88 218.44,181.61 254,146.05 U$1.D11
D13  (via drill 0.6)
  Top 0.406: U$1.D13 259.08,101.6 240.03,101.6 | 240.03,101.6 U9.11 | 240.03,101.6 236.22,102.87 v233.68,102.87 | v216,105.41 216,104.24 215.9,104.14 v203.2,104.14
  Bottom 0.406: U1.11 201.93,177.8 194.31,170.18 194.31,165.1 201.93,165.1 U2.11 201.93,156.21 194.31,148.59 194.31,139.7 200.66,139.7 201.93,138.43 U3.11 201.93,128.27 194.31,120.65 194.31,114.3 200.66,114.3 201.93,113.03 U4.11 201.93,104.14 | 201.93,104.14 194.31,96.52 194.31,88.9 200.66,88.9 201.93,87.63 U5.11 201.93,80.01 194.31,72.39 194.31,63.5 200.66,63.5 201.93,62.23 U6.11 201.93,54.61 194.31,46.99 194.31,38.1 200.66,38.1 201.93,36.83 U7.11 201.93,29.21 194.31,21.59 194.31,12.7 200.66,12.7 201.93,11.43 U8.11 | v233.68,102.87 218.44,102.87 215.9,105.41 v216,105.41 | v203.2,104.14 201.93,104.14
GND
  Bottom 0.406: Q4.1 223.52,191.77 224.79,193.04 228.6,193.04 229.87,191.77 Q9.1 | Q3.1 223.52,166.37 224.79,167.64 228.6,167.64 229.87,166.37 Q10.1 | Q2.1 223.52,140.97 224.79,142.24 228.6,142.24 229.87,140.97 Q11.1 | Q1.1 223.52,115.57 224.79,116.84 228.6,116.84 229.87,115.57 Q12.1 | Q5.1 223.52,90.17 224.79,91.44 228.6,91.44 229.87,90.17 Q16.1 | Q6.1 223.52,64.77 224.79,66.04 228.6,66.04 229.87,64.77 Q15.1 | Q7.1 223.52,39.37 224.79,40.64 228.6,40.64 229.87,39.37 Q14.1 | Q8.1 223.52,13.97 224.79,15.24 228.6,15.24 229.87,13.97 Q13.1
  pour Top: 0,0 279.4,0 279.4,203.2 0,203.2
GND_PLANE1
  Top 0.406: Q9.3 227.33,191.77 226.06,193.04 222.25,193.04 220.98,191.77 Q4.3
  Bottom 0.406: Q4.3 194.31,190.5 191.77,193.04 10.16,193.04 J65.1
GND_PLANE2  (via drill 0.6)
  Top 0.406: Q3.3 220.98,166.37 222.25,167.64 226.06,167.64 227.33,166.37 Q10.3 | v195.58,154.94 v214.63,154.94
  Bottom 0.406: J66.1 7.62,163.83 10.16,161.29 189.23,161.29 v195.58,154.94 | v214.63,154.94 214.63,156.21 219.71,161.29 219.71,163.83 Q3.3
GND_PLANE3  (via drill 0.6)
  Top 0.406: Q11.3 227.33,140.97 226.06,142.24 222.25,142.24 220.98,140.97 Q2.3 218.44,137.16 218.44,134.62 215.9,132.08 v194.31,132.08
  Bottom 0.406: J67.1 7.62,138.43 10.16,135.89 190.5,135.89 v194.31,132.08
GND_PLANE4  (via drill 0.6)
  Top 0.406: Q1.3 220.98,115.57 222.25,116.84 226.06,116.84 227.33,115.57 Q12.3 | v199.39,105.41 v214.63,105.41
  Bottom 0.406: J68.1 7.62,113.03 11.43,109.22 190.5,109.22 194.31,105.41 v199.39,105.41 | v214.63,105.41 214.63,106.68 219.71,111.76 219.71,113.03 Q1.3
GND_PLANE5  (via drill 0.6)
  Top 0.406: Q5.3 220.98,90.17 222.25,91.44 226.06,91.44 227.33,90.17 Q16.3 | v198.12,80.01 v214.63,80.01
  Bottom 0.406: J69.1 7.62,87.63 11.43,83.82 191.77,83.82 195.58,80.01 v198.12,80.01 | v214.63,80.01 214.63,81.28 218.44,85.09 218.44,86.36 Q5.3
GND_PLANE6  (via drill 0.6)
  Top 0.406: Q6.3 220.98,64.77 222.25,66.04 226.06,66.04 227.33,64.77 Q15.3 | v198.12,54.61 215.9,54.61 v216.02,54.73
  Bottom 0.406: J70.1 7.62,62.23 11.43,58.42 191.77,58.42 195.58,54.61 v198.12,54.61 | v216.02,54.73 216.02,58.54 Q6.3
GND_PLANE7  (via drill 0.6)
  Top 0.406: v195.58,36.83 v208.28,36.83 | Q7.3 220.98,39.37 222.25,40.64 226.06,40.64 227.33,39.37 Q14.3
  Bottom 0.406: J71.1 7.62,36.83 13.97,30.48 189.23,30.48 v195.58,36.83 | v208.28,36.83 219.71,36.83 Q7.3
GND_PLANE8
  Top 0.406: Q8.3 220.98,13.97 222.25,15.24 226.06,15.24 227.33,13.97 Q13.3
  Bottom 0.406: J72.1 11.43,8.89 193.04,8.89 196.85,5.08 215.9,5.08 218.44,7.62 218.44,10.16 Q8.3
LED1
  Top 0.61: R1.2 J1.1
LED2
  Top 0.61: R2.2 J2.1
LED3
  Top 0.61: R3.2 J3.1
LED4
  Top 0.61: R4.2 J4.1
LED5
  Top 0.61: R5.2 J5.1
LED6
  Top 0.61: R6.2 J6.1
LED7
  Top 0.61: R7.2 J7.1
LED8
  Top 0.61: R8.2 J8.1
LED9
  Top 0.406: R9.2 J9.1
LED10
  Top 0.406: R10.2 J10.1
LED11
  Top 0.406: R11.2 J11.1
LED12
  Top 0.406: R12.2 J12.1
LED13
  Top 0.406: R13.2 J13.1
LED14
  Top 0.406: R14.2 J14.1
LED15
  Top 0.406: R15.2 J15.1
LED16
  Top 0.406: R16.2 J16.1
LED17
  Top 0.406: R17.2 J17.1
LED18
  Top 0.406: R18.2 J18.1
LED19
  Top 0.406: R19.2 J19.1
LED20
  Top 0.406: R20.2 J20.1
LED21
  Top 0.406: R21.2 J21.1
LED22
  Top 0.406: R22.2 J22.1
LED23
  Top 0.406: R23.2 J23.1
LED24
  Top 0.406: R24.2 J24.1
LED25
  Top 0.406: J25.1 R25.2
LED26
  Top 0.406: J26.1 R26.2
LED27
  Top 0.406: J27.1 R27.2
LED28
  Top 0.406: J28.1 R28.2
LED29
  Top 0.406: J29.1 R29.2
LED30
  Top 0.406: J30.1 R30.2
LED31
  Top 0.406: J31.1 R31.2
LED32
  Top 0.406: R32.2 J32.1
LED33
  Top 0.406: R33.2 J33.1
LED34
  Top 0.406: R34.2 J34.1
LED35
  Top 0.406: R35.2 J35.1
LED36
  Top 0.406: R36.2 J36.1
LED37
  Top 0.406: R37.2 J37.1
LED38
  Top 0.406: J38.1 R38.2
LED39
  Top 0.406: R39.2 J39.1
LED40
  Top 0.406: J40.1 R40.2
LED41
  Top 0.406: R41.2 J41.1
LED42
  Top 0.406: R42.2 J42.1
LED43
  Top 0.406: R43.2 J43.1
LED44
  Top 0.406: R44.2 J44.1
LED45
  Top 0.406: R45.2 J45.1
LED46
  Top 0.406: R46.2 J46.1
LED47
  Top 0.406: R47.2 J47.1
LED48
  Top 0.406: J48.1 R48.2
LED49
  Top 0.406: J49.1 R49.2
LED50
  Top 0.406: J50.1 R50.2
LED51
  Top 0.406: J51.1 R51.2
LED52
  Top 0.406: J52.1 R52.2
LED53
  Top 0.406: J53.1 R53.2
LED54
  Top 0.406: J54.1 R54.2
LED55
  Top 0.406: J55.1 R55.2
LED56
  Top 0.406: R56.2 J56.1
LED57
  Top 0.406: J57.1 R57.2
LED58
  Top 0.406: J58.1 R58.2
LED59
  Top 0.406: J59.1 R59.2
LED60
  Top 0.406: J60.1 R60.2
LED61
  Top 0.406: J61.1 R61.2
LED62
  Top 0.406: J62.1 R62.2
LED63
  Top 0.406: J63.1 R63.2
LED64
  Top 0.406: J64.1 R64.2
N$1
  Top 0.406: R1.1 31.75,190.5 38.1,184.15 212.09,184.15 U1.15
N$2
  Top 0.406: R2.1 58.42,190.5 63.5,185.42 191.77,185.42 195.58,189.23 212.09,189.23 214.63,191.77 U1.1
N$3
  Top 0.406: U1.2 212.09,191.77 210.82,190.5 195.58,190.5 191.77,186.69 73.39,186.69 R3.1
N$4  (via drill 0.6)
  Top 0.406: v196.85,181.61 217.17,181.61 217.17,167.64 214.63,165.1 210.82,165.1 209.55,163.83 U2.14
  Bottom 0.406: U1.9 v196.85,181.61
N$5  (via drill 0.6)
  Top 0.406: v196.85,157.48 217.17,157.48 217.17,142.24 214.63,139.7 210.82,139.7 209.55,138.43 U3.14
  Bottom 0.406: U2.9 v196.85,157.48
N$6  (via drill 0.6)
  Top 0.406: v196.85,130.81 217.17,130.81 217.17,115.57 215.9,114.3 210.82,114.3 209.55,113.03 U4.14
  Bottom 0.406: U3.9 v196.85,130.81
N$7  (via drill 0.6)
  Top 0.406: v196.85,106.68 217.17,106.68 217.17,90.17 215.9,88.9 210.82,88.9 209.55,87.63 U5.14
  Bottom 0.406: U4.9 v196.85,106.68
N$8  (via drill 0.6)
  Top 0.406: v196.85,81.28 217.17,81.28 217.17,64.77 215.9,63.5 210.82,63.5 209.55,62.23 U6.14
  Bottom 0.406: U5.9 v196.85,81.28
N$9  (via drill 0.6)
  Top 0.406: v196.85,55.88 217.17,55.88 217.17,39.37 215.9,38.1 210.82,38.1 209.55,36.83 U7.14
  Bottom 0.406: U6.9 v196.85,55.88
N$10  (via drill 0.6)
  Top 0.406: v196.85,30.48 217.17,30.48 217.17,13.97 215.9,12.7 210.82,12.7 209.55,11.43 U8.14
  Bottom 0.406: U7.9 v196.85,30.48
N$11
  Top 0.406: U1.3 209.55,201.93 106.41,201.93 R4.1
N$12
  Top 0.406: U1.4 207.01,200.66 130.54,200.66 R5.1
N$13
  Top 0.406: U1.5 204.47,199.39 154.67,199.39 R6.1
N$14
  Top 0.406: U1.6 201.93,198.12 178.8,198.12 R7.1
N$15
  Top 0.406: R8.1 184.42,193.31 187.96,196.85 199.39,196.85 U1.7
N$16
  Top 0.406: U2.15 212.09,158.75 38.1,158.75 31.75,165.1 R9.1
N$17
  Top 0.406: U2.1 214.63,179.07 58.15,179.07 R10.1
N$18
  Top 0.406: U2.2 212.09,177.8 82.28,177.8 R11.1
N$19
  Top 0.406: U2.3 209.55,176.53 106.41,176.53 R12.1
N$20
  Top 0.406: U2.4 207.01,175.26 130.54,175.26 R13.1
N$21
  Top 0.406: U2.5 204.47,173.99 154.67,173.99 R14.1
N$22
  Top 0.406: R15.1 171.45,165.1 179.07,172.72 201.93,172.72 U2.6
N$23
  Top 0.406: R16.1 184.42,167.91 187.96,171.45 199.39,171.45 U2.7
N$24
  Top 0.406: U3.15 212.09,133.35 38.1,133.35 31.75,139.7 R17.1
N$25
  Top 0.406: U3.1 214.63,153.67 55.88,153.67 44.45,142.24 44.45,139.97 R18.1
N$26
  Top 0.406: U3.2 212.09,152.4 78.74,152.4 69.85,142.24 69.85,139.97 R19.1
N$27
  Top 0.406: U3.3 209.55,151.13 104.14,151.13 95.25,142.24 95.25,139.97 R20.1
N$28
  Top 0.406: U3.4 207.01,149.86 128.27,149.86 120.65,142.24 120.65,139.97 R21.1
N$29
  Top 0.406: U3.5 204.47,148.59 152.4,148.59 146.05,142.24 146.05,139.97 R22.1
N$30
  Top 0.406: U3.6 201.93,147.32 176.53,147.32 171.45,142.24 171.45,139.97 R23.1
N$31
  Top 0.406: U3.7 199.39,146.05 187.96,146.05 184.15,142.24 184.15,139.97 R24.1
N$32
  Top 0.406: U4.15 212.09,107.95 38.1,107.95 31.75,114.3 R25.1
N$33
  Top 0.406: U4.1 214.63,128.27 57.15,128.27 44.45,116.84 44.45,114.57 R26.1
N$34
  Top 0.406: U4.2 212.09,127 80.01,127 69.85,116.84 69.85,114.57 R27.1
N$35
  Top 0.406: U4.3 209.55,125.73 104.14,125.73 95.25,116.84 95.25,114.57 R28.1
N$36
  Top 0.406: U4.4 207.01,124.46 128.27,124.46 120.65,116.84 120.65,114.57 R29.1
N$37
  Top 0.406: U4.5 204.47,123.19 152.4,123.19 146.05,116.84 146.05,114.57 R30.1
N$38
  Top 0.406: U4.6 201.93,121.92 176.53,121.92 171.45,116.84 171.45,114.57 R31.1
N$39
  Top 0.406: U4.7 199.39,120.65 187.96,120.65 184.15,116.84 184.15,114.57 R32.1
N$40
  Top 0.406: U5.15 212.09,82.55 38.1,82.55 31.75,88.9 R33.1
N$41
  Top 0.406: U5.1 214.63,102.87 55.88,102.87 44.45,91.44 44.45,89.17 R34.1
N$42
  Top 0.406: U5.2 212.09,101.6 80.01,101.6 69.85,91.44 69.85,89.17 R35.1
N$43
  Top 0.406: U5.3 209.55,100.33 104.14,100.33 95.25,91.44 95.25,89.17 R36.1
N$44
  Top 0.406: U5.4 207.01,99.06 128.27,99.06 120.65,91.44 120.65,89.17 R37.1
N$45
  Top 0.406: U5.5 204.47,97.79 152.4,97.79 146.05,91.44 146.05,89.17 R38.1
N$46
  Top 0.406: U5.6 201.93,96.52 176.53,96.52 171.45,91.44 171.45,89.17 R39.1
N$47
  Top 0.406: U5.7 199.39,95.25 187.96,95.25 184.15,91.44 184.15,89.17 R40.1
N$48
  Top 0.406: U6.15 212.09,57.15 38.1,57.15 31.75,63.5 R41.1
N$49
  Top 0.406: U6.1 214.63,77.47 54.61,77.47 44.45,66.04 44.45,63.77 R42.1
N$50
  Top 0.406: U6.2 212.09,76.2 80.01,76.2 69.85,66.04 69.85,63.77 R43.1
N$51
  Top 0.406: U6.3 209.55,74.93 104.14,74.93 95.25,66.04 95.25,63.77 R44.1
N$52
  Top 0.406: U6.4 207.01,73.66 128.27,73.66 120.65,66.04 120.65,63.77 R45.1
N$53
  Top 0.406: U6.5 204.47,72.39 152.4,72.39 146.05,66.04 146.05,63.77 R46.1
N$54
  Top 0.406: U6.6 201.93,71.12 176.53,71.12 171.45,66.04 171.45,63.77 R47.1
N$55
  Top 0.406: U6.7 199.39,69.85 187.96,69.85 184.15,66.04 184.15,63.77 R48.1
N$56
  Top 0.406: U7.15 212.09,31.75 38.1,31.75 31.75,38.1 R49.1
N$57
  Top 0.406: U7.1 214.63,52.07 55.88,52.07 44.45,40.64 44.45,38.37 R50.1
N$58
  Top 0.406: U7.2 212.09,50.8 80.01,50.8 69.85,40.64 69.85,38.37 R51.1
N$59
  Top 0.406: U7.3 209.55,49.53 104.14,49.53 95.25,40.64 95.25,38.37 R52.1
N$60
  Top 0.406: U7.4 207.01,48.26 128.27,48.26 120.65,40.64 120.65,38.37 R53.1
N$61
  Top 0.406: U7.5 204.47,46.99 152.4,46.99 146.05,40.64 146.05,38.37 R54.1
N$62
  Top 0.406: U7.6 201.93,45.72 176.53,45.72 171.45,40.64 171.45,38.37 R55.1
N$63
  Top 0.406: U7.7 199.39,44.45 187.96,44.45 184.15,40.64 184.15,38.37 R56.1
N$65
  Top 0.406: U8.15 212.09,6.35 38.1,6.35 31.75,12.7 R57.1
N$66
  Top 0.406: U8.1 214.63,26.67 55.88,26.67 44.45,15.24 44.45,12.97 R58.1
N$67
  Top 0.406: U8.2 212.09,25.4 80.01,25.4 69.85,15.24 69.85,12.97 R59.1
N$68
  Top 0.406: U8.3 209.55,24.13 104.14,24.13 95.25,15.24 95.25,12.97 R60.1
N$69
  Top 0.406: U8.4 207.01,22.86 128.27,22.86 120.65,15.24 120.65,12.97 R61.1
N$70
  Top 0.406: U8.5 204.47,21.59 152.4,21.59 146.05,15.24 146.05,12.97 R62.1
N$71
  Top 0.406: U8.6 201.93,20.32 176.53,20.32 171.45,15.24 171.45,12.97 R63.1
N$72
  Top 0.406: U8.7 199.39,19.05 187.96,19.05 184.15,15.24 184.15,12.97 R64.1
N$73
  Top 0.813: 275.59,198.12 276.86,199.39
N$81  (via drill 0.6)
  Top 0.406: U8.9 191.77,8.89 v190.5,7.62 | v252.73,86.36 250.19,86.36 247.65,88.9 U9.14
  Bottom 0.406: v190.5,7.62 190.5,3.81 191.77,2.54 227.33,2.54 246.38,21.59 246.38,63.5 257.81,74.93 257.81,81.28 v252.73,86.36

### Text on the board
tPlace: LED Cube Rev.A | Shawn Victor / Jonathan Rosenzweig / Keeshan Patel
tOrigins: GP1 | GP2 | GP3 | GP4 | GP5 | + | - | + | GP6 | - | s | + | - | s | GP7 | GP8